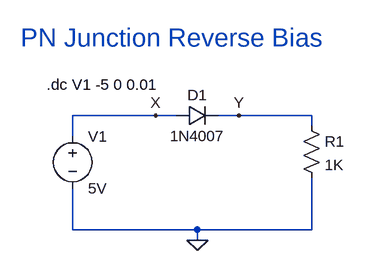
[diagram p0: schematic PN diode Reversebias.asc]
PN diode Reversebias.asc, the LTspice schematic file:
Version 4
SHEET 1 880 680
WIRE 160 144 32 144
WIRE 192 144 160 144
WIRE 288 144 256 144
WIRE 400 144 288 144
WIRE 400 160 400 144
WIRE 32 176 32 144
WIRE 32 320 32 256
WIRE 224 320 32 320
WIRE 400 320 400 240
WIRE 400 320 224 320
WIRE 224 336 224 320
FLAG 224 336 0
FLAG 160 144 X
FLAG 288 144 Y
SYMBOL diode 192 160 R270
WINDOW 0 32 32 VTop 2
WINDOW 3 0 32 VBottom 2
SYMATTR InstName D1
SYMATTR Value 1N4007
SYMBOL res 384 144 R0
SYMATTR InstName R1
SYMATTR Value 1K
SYMBOL voltage 32 160 R0
SYMATTR InstName V1
SYMATTR Value 5V
TEXT -8 96 Left 2 !.dc V1 -5 0 0.01
TEXT -48 24 Left 4 ;PN Junction Reverse Bias

The netlist it stands for:
* PN diode Reversebias.asc
D1 X Y 1N4007
R1 Y 0 1K
V1 X 0 5V
.model D D
.lib standard.dio
.dc V1 -5 0 0.01
* PN Junction Reverse Bias
.backanno
.end